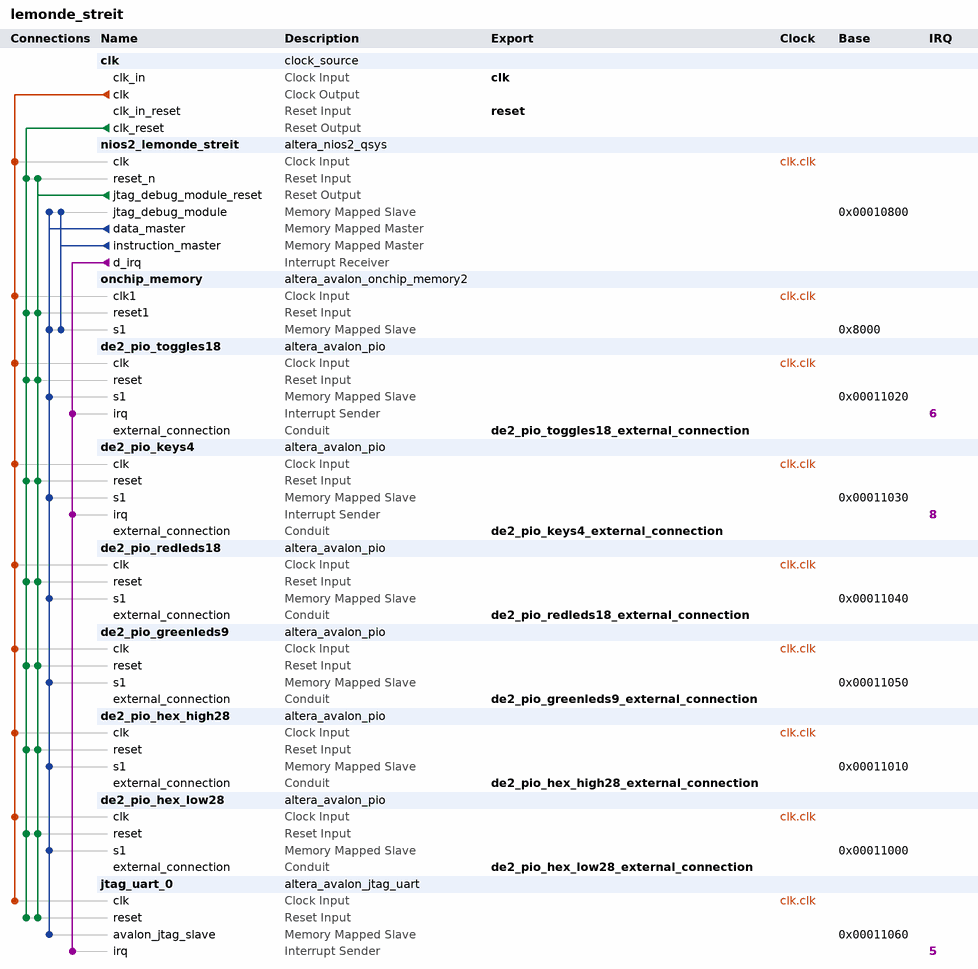
[diagram p0: system contents]
# Platform Designer (Qsys) system lemonde_streit, Cyclone II Unknown
# Parameters at their usual value, and those the tool derives, are not listed.
package require -exact qsys 13.0.1.99.2
create_system lemonde_streit
set_project_property DEVICE_FAMILY {Cyclone II}
set_project_property DEVICE Unknown

add_instance clk clock_source 13.0
set_instance_parameter_value clk clockFrequency 50000000

add_instance nios2_lemonde_streit altera_nios2_qsys 13.0
set_instance_parameter_value nios2_lemonde_streit resetSlave onchip_memory.s1
set_instance_parameter_value nios2_lemonde_streit mmu_TLBMissExcSlave None
set_instance_parameter_value nios2_lemonde_streit exceptionSlave onchip_memory.s1
set_instance_parameter_value nios2_lemonde_streit breakSlave nios2_lemonde_streit.jtag_debug_module
set_instance_parameter_value nios2_lemonde_streit impl Tiny
set_instance_parameter_value nios2_lemonde_streit icache_size 4096

add_instance onchip_memory altera_avalon_onchip_memory2 13.0.1.99.2
set_instance_parameter_value onchip_memory dataWidth 32
set_instance_parameter_value onchip_memory dualPort false
set_instance_parameter_value onchip_memory initMemContent true
set_instance_parameter_value onchip_memory initializationFileName onchip_mem.hex
set_instance_parameter_value onchip_memory memorySize 32768

add_instance de2_pio_toggles18 altera_avalon_pio 13.0.1.99.2
set_instance_parameter_value de2_pio_toggles18 captureEdge true
set_instance_parameter_value de2_pio_toggles18 direction Input
set_instance_parameter_value de2_pio_toggles18 edgeType ANY
set_instance_parameter_value de2_pio_toggles18 generateIRQ true
set_instance_parameter_value de2_pio_toggles18 width 18

add_instance de2_pio_keys4 altera_avalon_pio 13.0.1.99.2
set_instance_parameter_value de2_pio_keys4 captureEdge true
set_instance_parameter_value de2_pio_keys4 direction Input
set_instance_parameter_value de2_pio_keys4 edgeType ANY
set_instance_parameter_value de2_pio_keys4 generateIRQ true
set_instance_parameter_value de2_pio_keys4 width 4

add_instance de2_pio_redleds18 altera_avalon_pio 13.0.1.99.2
set_instance_parameter_value de2_pio_redleds18 direction Output
set_instance_parameter_value de2_pio_redleds18 width 18

add_instance de2_pio_greenleds9 altera_avalon_pio 13.0.1.99.2
set_instance_parameter_value de2_pio_greenleds9 direction Output
set_instance_parameter_value de2_pio_greenleds9 width 9

add_instance de2_pio_hex_high28 altera_avalon_pio 13.0.1.99.2
set_instance_parameter_value de2_pio_hex_high28 direction Output
set_instance_parameter_value de2_pio_hex_high28 width 28

add_instance de2_pio_hex_low28 altera_avalon_pio 13.0.1.99.2
set_instance_parameter_value de2_pio_hex_low28 direction Output
set_instance_parameter_value de2_pio_hex_low28 width 28

add_instance jtag_uart_0 altera_avalon_jtag_uart 13.0.1.99.2
set_instance_parameter_value jtag_uart_0 simInteractiveOptions NO_INTERACTIVE_WINDOWS

# connections
add_connection clk.clk de2_pio_greenleds9.clk clock
add_connection clk.clk de2_pio_hex_high28.clk clock
add_connection clk.clk de2_pio_hex_low28.clk clock
add_connection clk.clk de2_pio_keys4.clk clock
add_connection clk.clk de2_pio_redleds18.clk clock
add_connection clk.clk de2_pio_toggles18.clk clock
add_connection clk.clk jtag_uart_0.clk clock
add_connection clk.clk nios2_lemonde_streit.clk clock
add_connection clk.clk onchip_memory.clk1 clock
add_connection clk.clk_reset de2_pio_greenleds9.reset reset
add_connection clk.clk_reset de2_pio_hex_high28.reset reset
add_connection clk.clk_reset de2_pio_hex_low28.reset reset
add_connection clk.clk_reset de2_pio_keys4.reset reset
add_connection clk.clk_reset de2_pio_redleds18.reset reset
add_connection clk.clk_reset de2_pio_toggles18.reset reset
add_connection clk.clk_reset jtag_uart_0.reset reset
add_connection clk.clk_reset nios2_lemonde_streit.reset_n reset
add_connection clk.clk_reset onchip_memory.reset1 reset
add_connection nios2_lemonde_streit.jtag_debug_module_reset de2_pio_greenleds9.reset reset
add_connection nios2_lemonde_streit.jtag_debug_module_reset de2_pio_hex_high28.reset reset
add_connection nios2_lemonde_streit.jtag_debug_module_reset de2_pio_hex_low28.reset reset
add_connection nios2_lemonde_streit.jtag_debug_module_reset de2_pio_keys4.reset reset
add_connection nios2_lemonde_streit.jtag_debug_module_reset de2_pio_redleds18.reset reset
add_connection nios2_lemonde_streit.jtag_debug_module_reset de2_pio_toggles18.reset reset
add_connection nios2_lemonde_streit.jtag_debug_module_reset jtag_uart_0.reset reset
add_connection nios2_lemonde_streit.jtag_debug_module_reset nios2_lemonde_streit.reset_n reset
add_connection nios2_lemonde_streit.jtag_debug_module_reset onchip_memory.reset1 reset
add_connection nios2_lemonde_streit.data_master de2_pio_greenleds9.s1 avalon
set_connection_parameter_value nios2_lemonde_streit.data_master/de2_pio_greenleds9.s1 baseAddress 0x00011050
add_connection nios2_lemonde_streit.data_master de2_pio_hex_high28.s1 avalon
set_connection_parameter_value nios2_lemonde_streit.data_master/de2_pio_hex_high28.s1 baseAddress 0x00011010
add_connection nios2_lemonde_streit.data_master de2_pio_hex_low28.s1 avalon
set_connection_parameter_value nios2_lemonde_streit.data_master/de2_pio_hex_low28.s1 baseAddress 0x00011000
add_connection nios2_lemonde_streit.data_master de2_pio_keys4.s1 avalon
set_connection_parameter_value nios2_lemonde_streit.data_master/de2_pio_keys4.s1 baseAddress 0x00011030
add_connection nios2_lemonde_streit.data_master de2_pio_redleds18.s1 avalon
set_connection_parameter_value nios2_lemonde_streit.data_master/de2_pio_redleds18.s1 baseAddress 0x00011040
add_connection nios2_lemonde_streit.data_master de2_pio_toggles18.s1 avalon
set_connection_parameter_value nios2_lemonde_streit.data_master/de2_pio_toggles18.s1 baseAddress 0x00011020
add_connection nios2_lemonde_streit.data_master jtag_uart_0.avalon_jtag_slave avalon
set_connection_parameter_value nios2_lemonde_streit.data_master/jtag_uart_0.avalon_jtag_slave baseAddress 0x00011060
add_connection nios2_lemonde_streit.data_master nios2_lemonde_streit.jtag_debug_module avalon
set_connection_parameter_value nios2_lemonde_streit.data_master/nios2_lemonde_streit.jtag_debug_module baseAddress 0x00010800
add_connection nios2_lemonde_streit.data_master onchip_memory.s1 avalon
set_connection_parameter_value nios2_lemonde_streit.data_master/onchip_memory.s1 baseAddress 0x8000
add_connection nios2_lemonde_streit.instruction_master nios2_lemonde_streit.jtag_debug_module avalon
set_connection_parameter_value nios2_lemonde_streit.instruction_master/nios2_lemonde_streit.jtag_debug_module baseAddress 0x00010800
add_connection nios2_lemonde_streit.instruction_master onchip_memory.s1 avalon
set_connection_parameter_value nios2_lemonde_streit.instruction_master/onchip_memory.s1 baseAddress 0x8000
add_connection nios2_lemonde_streit.d_irq de2_pio_keys4.irq interrupt
set_connection_parameter_value nios2_lemonde_streit.d_irq/de2_pio_keys4.irq irqNumber 8
add_connection nios2_lemonde_streit.d_irq de2_pio_toggles18.irq interrupt
set_connection_parameter_value nios2_lemonde_streit.d_irq/de2_pio_toggles18.irq irqNumber 6
add_connection nios2_lemonde_streit.d_irq jtag_uart_0.irq interrupt
set_connection_parameter_value nios2_lemonde_streit.d_irq/jtag_uart_0.irq irqNumber 5

# exported interfaces
add_interface clk clock sink
set_interface_property clk EXPORT_OF clk.clk_in
add_interface reset reset sink
set_interface_property reset EXPORT_OF clk.clk_in_reset
add_interface de2_pio_toggles18_external_connection conduit end
set_interface_property de2_pio_toggles18_external_connection EXPORT_OF de2_pio_toggles18.external_connection
add_interface de2_pio_keys4_external_connection conduit end
set_interface_property de2_pio_keys4_external_connection EXPORT_OF de2_pio_keys4.external_connection
add_interface de2_pio_redleds18_external_connection conduit end
set_interface_property de2_pio_redleds18_external_connection EXPORT_OF de2_pio_redleds18.external_connection
add_interface de2_pio_hex_high28_external_connection conduit end
set_interface_property de2_pio_hex_high28_external_connection EXPORT_OF de2_pio_hex_high28.external_connection
add_interface de2_pio_hex_low28_external_connection conduit end
set_interface_property de2_pio_hex_low28_external_connection EXPORT_OF de2_pio_hex_low28.external_connection
add_interface de2_pio_greenleds9_external_connection conduit end
set_interface_property de2_pio_greenleds9_external_connection EXPORT_OF de2_pio_greenleds9.external_connection

set_interconnect_requirement {$system} qsys_mm.clockCrossingAdapter HANDSHAKE
set_interconnect_requirement {$system} qsys_mm.maxAdditionalLatency 1

save_system lemonde_streit.qsys
